# Altium project BW2098POE.PrjPcb (part 8 of 8)
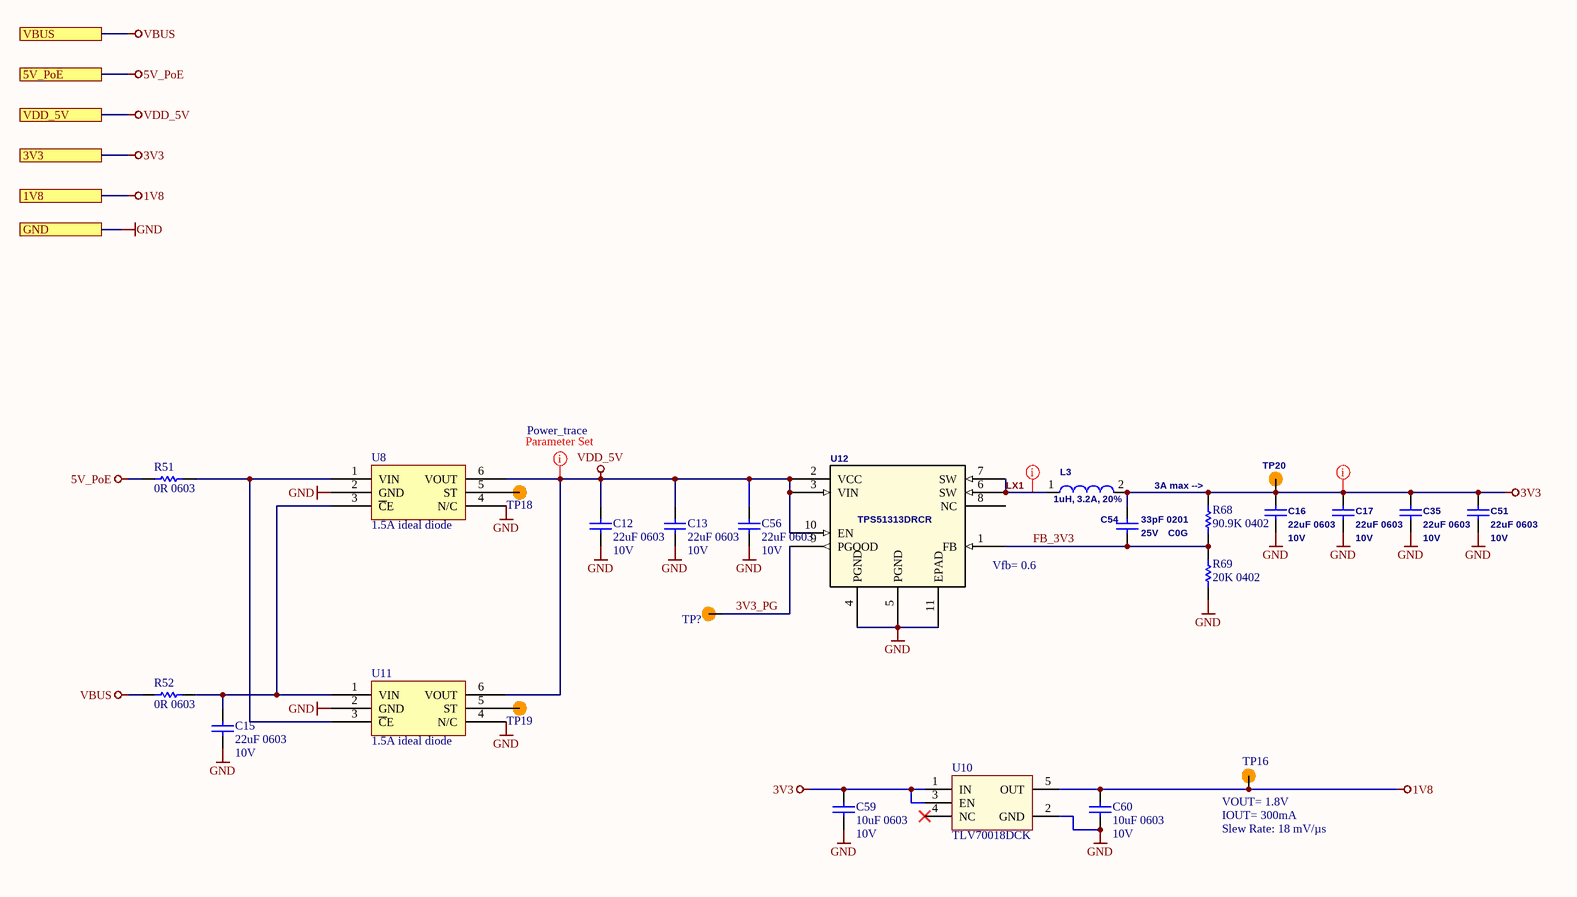
[diagram p15: POWER_GEN.SchDoc]

## Nets that join several sheets
1V8: ETH_PCIE_PHY (C52.2 R50.2 U6.3), PCIE_CLK (C18.2 R6.2 U3.3), BOOT_JTAG_AUX (8 pins), POWER_GEN (C60.2 TP16.1 U10.5)
3V3: ETH_PCIE_PHY (15 pins), RJ45 (D16.2 J1.15 J1.17), PCIE_CLK (21 pins), BW2098_USB (C74.2 R186.2 U61.6), BOOT_JTAG_AUX (C55.2 J4.9 J7.4), POWER_GEN (11 pins)
5V_IN: TopLevel (J10.2), CONNECTOR_B (8 pins)
5V_PoE: TopLevel (J10.1), PoE_Si3404 (7 pins)
GND: TopLevel (8 pins), CONNECTOR_B (23 pins), CONNECTOR_A (20 pins), ETH_PCIE_PHY (24 pins), RJ45 (7 pins), PCIE_CLK (21 pins), BW2098_MIPI_CAM (11 pins), BW2098_USB (22 pins), BOOT_JTAG_AUX (24 pins), PoE_Si3404 (9 pins), POWER_GEN (19 pins)
VBUS: CONNECTOR_B (J3.80), BW2098_USB (10 pins)
VNEG_IN: RJ45 (D1.4 D8.4), PoE_Si3404 (C33.1 FB3.1)
2485_PGOOD: CONNECTOR_A (J2.37), BOOT_JTAG_AUX (J5.5 Q2.1)
2485_WAKEUP: CONNECTOR_A (J2.41), BOOT_JTAG_AUX (R1.2 R62.1)
AUX_IO_IRQ: CONNECTOR_A (J2.69), BOOT_JTAG_AUX (J5.3)
BOOT0: CONNECTOR_B (J3.26), BOOT_JTAG_AUX (R23.1 SW1.6)
BOOT1: CONNECTOR_B (J3.24), BOOT_JTAG_AUX (R22.1 SW1.5)
BOOT2: CONNECTOR_B (J3.22), BOOT_JTAG_AUX (R21.1 SW1.4)
BOOT3: CONNECTOR_B (J3.20), BOOT_JTAG_AUX (R20.1 SW1.3)
BOOT4: CONNECTOR_B (J3.18), BOOT_JTAG_AUX (R19.1 SW1.2)
BRIDGE_REFCLK_N: ETH_PCIE_PHY (U4.16), PCIE_CLK (R33.1 R43.2 R72.2)
BRIDGE_REFCLK_P: ETH_PCIE_PHY (U4.15), PCIE_CLK (R42.2 R65.1 R71.2)
CAM_A_CLK: CONNECTOR_A (J2.28), BW2098_MIPI_CAM (J6.18 TP4.1)
CAM_A_PWDN_N: CONNECTOR_A (J2.34), BW2098_MIPI_CAM (J6.17 TP17.1)
GPIO7/sd_hst_cd: CONNECTOR_A (J2.59), BOOT_JTAG_AUX (R66.2)
GPIO8: CONNECTOR_A (J2.60), BOOT_JTAG_AUX (J8.7)
GPIO58: CONNECTOR_B (J3.28 R27.1), BOOT_JTAG_AUX (R63.1 SW1.1)
I2C0_SCL: CONNECTOR_B (J3.34), BOOT_JTAG_AUX (TP1.1)
I2C0_SDA: CONNECTOR_B (J3.36), BOOT_JTAG_AUX (TP2.1)
I2C1_SCL: CONNECTOR_A (J2.35), BW2098_MIPI_CAM (J6.20)
I2C1_SDA: CONNECTOR_A (J2.33), BW2098_MIPI_CAM (J6.21)
I2C3_SCL: CONNECTOR_A (J2.78), BOOT_JTAG_AUX (J5.2)
I2C3_SDA: CONNECTOR_A (J2.80), BOOT_JTAG_AUX (J5.4)
I2C4_SCL_1V8: CONNECTOR_B (J3.59), PCIE_CLK (U3.4)
I2C4_SDA_1V8: CONNECTOR_B (J3.57), PCIE_CLK (U3.5)
LED0_10_GRN: ETH_PCIE_PHY (U4.27), RJ45 (R57.1)
LED1_100_OR: ETH_PCIE_PHY (U4.26), RJ45 (R58.1)
LED2_1000_GRN: ETH_PCIE_PHY (U4.25), RJ45 (R59.1)
MD1_N: ETH_PCIE_PHY (U4.2), RJ45 (D17.2 D17.9 J1.2)
MD1_P: ETH_PCIE_PHY (U4.1), RJ45 (D17.1 D17.10 J1.1)
MD2_N: ETH_PCIE_PHY (U4.5), RJ45 (D17.5 D17.6 J1.6)
MD2_P: ETH_PCIE_PHY (U4.4), RJ45 (D17.4 D17.7 J1.3)
MD3_N: ETH_PCIE_PHY (U4.7), RJ45 (D18.2 D18.9 J1.8)
MD3_P: ETH_PCIE_PHY (U4.6), RJ45 (D18.1 D18.10 J1.7)
MD4_N: ETH_PCIE_PHY (U4.10), RJ45 (D18.5 D18.6 J1.10)
MD4_P: ETH_PCIE_PHY (U4.9), RJ45 (D18.4 D18.7 J1.9)
MIPI_C_N: CONNECTOR_A (J2.3), BW2098_MIPI_CAM (J6.8)
MIPI_C_P: CONNECTOR_A (J2.5), BW2098_MIPI_CAM (J6.9)
MIPI_D0_N: CONNECTOR_A (J2.9), BW2098_MIPI_CAM (J6.2)
MIPI_D0_P: CONNECTOR_A (J2.11), BW2098_MIPI_CAM (J6.3)
MIPI_D1_N: CONNECTOR_A (J2.15), BW2098_MIPI_CAM (J6.5)
MIPI_D1_P: CONNECTOR_A (J2.17), BW2098_MIPI_CAM (J6.6)
MIPI_D2_N: CONNECTOR_A (J2.21), BW2098_MIPI_CAM (J6.11)
MIPI_D2_P: CONNECTOR_A (J2.23), BW2098_MIPI_CAM (J6.12)
MIPI_D3_N: CONNECTOR_A (J2.27), BW2098_MIPI_CAM (J6.14)
MIPI_D3_P: CONNECTOR_A (J2.29), BW2098_MIPI_CAM (J6.15)
MODULE_nRST: CONNECTOR_A (B1.2 J2.39), BOOT_JTAG_AUX (J5.1 Q4.1)
PCIe_CLKREQ_N_1V8: CONNECTOR_B (J3.65), ETH_PCIE_PHY (U6.4)
PCIe_ISOLATE_N_1V8: CONNECTOR_B (R27.2), ETH_PCIE_PHY (U6.5)
PCIe_PERST_1V8: CONNECTOR_B (J3.63), ETH_PCIE_PHY (Q1.1)
sd_hst0_clk: CONNECTOR_A (J2.61), BOOT_JTAG_AUX (J7.5)
sd_hst0_cmd: CONNECTOR_A (J2.63), BOOT_JTAG_AUX (J7.3)
sd_hst0_dat_0: CONNECTOR_A (J2.40), BOOT_JTAG_AUX (J7.7)
sd_hst0_dat_1: CONNECTOR_A (J2.38), BOOT_JTAG_AUX (J7.8)
sd_hst0_dat_2: CONNECTOR_A (J2.36), BOOT_JTAG_AUX (J7.1)
sd_hst0_dat_3: CONNECTOR_A (J2.32), BOOT_JTAG_AUX (J7.2)
SDS_IO_CLKI_N: CONNECTOR_B (J3.81), PCIE_CLK (R36.1 R41.2 R72.1)
SDS_IO_CLKI_P: CONNECTOR_B (J3.83), PCIE_CLK (R34.1 R40.1 R71.1)
SDS_RXD_N: CONNECTOR_B (J3.77), ETH_PCIE_PHY (U4.18)
SDS_RXD_P: CONNECTOR_B (J3.75), ETH_PCIE_PHY (U4.17)
SDS_TXD_N: CONNECTOR_B (J3.71), ETH_PCIE_PHY (U4.14)
SDS_TXD_P: CONNECTOR_B (J3.69), ETH_PCIE_PHY (U4.13)
SPI_SCK: CONNECTOR_A (J2.74), BOOT_JTAG_AUX (J8.1)
SPI_SIO0: CONNECTOR_A (J2.62), BOOT_JTAG_AUX (J8.2)
SPI_SIO1: CONNECTOR_A (J2.64), BOOT_JTAG_AUX (J8.4)
SPI_SIO2: CONNECTOR_A (J2.66), BOOT_JTAG_AUX (J8.6)
SPI_SIO3: CONNECTOR_A (J2.68), BOOT_JTAG_AUX (J8.8)
SPI_SS_0: CONNECTOR_A (J2.70), BOOT_JTAG_AUX (J8.5)
SYS_RST: CONNECTOR_B (J3.89), BOOT_JTAG_AUX (J4.6)
TCK: CONNECTOR_B (J3.97), BOOT_JTAG_AUX (J4.2)
TDI: CONNECTOR_B (J3.95), BOOT_JTAG_AUX (J4.3)
TDO: CONNECTOR_B (J3.91), BOOT_JTAG_AUX (J4.5)
TMS: CONNECTOR_B (J3.99), BOOT_JTAG_AUX (J4.1)
TRST: CONNECTOR_B (J3.93), BOOT_JTAG_AUX (J4.4)
UART_RX: CONNECTOR_B (J3.42), BOOT_JTAG_AUX (J5.6)
UART_TX: CONNECTOR_B (J3.44), BOOT_JTAG_AUX (J5.8)
USB_D_N: CONNECTOR_B (J3.90), BW2098_USB (J14.A7 J14.B7)
USB_D_P: CONNECTOR_B (J3.92), BW2098_USB (J14.A6 J14.B6)
USB_RX_N: CONNECTOR_B (J3.96), BW2098_USB (U61.4)
USB_RX_P: CONNECTOR_B (J3.98), BW2098_USB (U61.3)
USB_TX_N: CONNECTOR_B (J3.84), BW2098_USB (U61.8)
USB_TX_P: CONNECTOR_B (J3.86), BW2098_USB (U61.7)
VPOS_IN: RJ45 (D1.1 D8.1), PoE_Si3404 (C33.2 FB2.1)

## Assembly variants
Production: not fitted C10 C11 C12 C13 C14 C15 C16 C17 C20 C27 C28 C29 C30 C31 C32 C51 D4 D17 D18 FB1 OS1 R1 R30 R33 R34 R35 R36 R37 R38 R39 R42 R43 R44 R45 R47 R51 R52 R64 R65 R? R? RZ1 RZ2 RZ28 RZ29 U7 U8